# Altium schematic sheet 02_Power.SchDoc
size A3
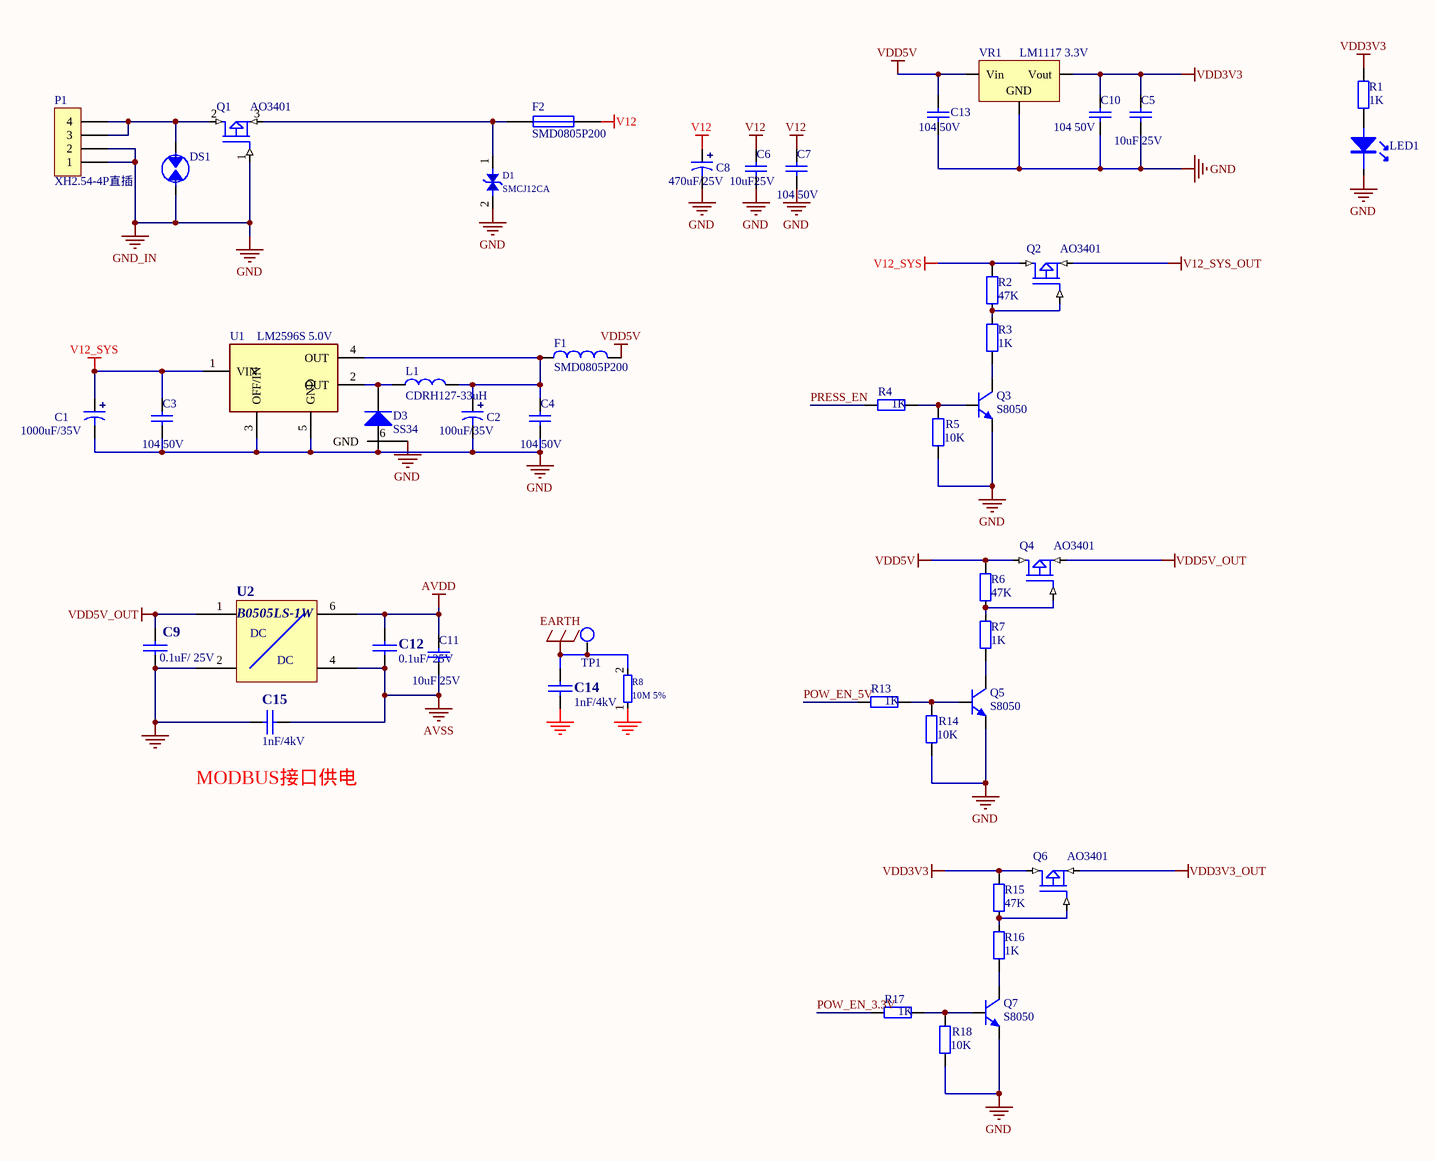
[diagram p0: 02_Power.SchDoc]

## Parts
C1  1000uF/35V  [10*16]
C2  100uF/35V  [6*8]
C3  104 50V  [SMD-0805C]
C4  104 50V  [SMD-0805C]
C5  10uF 25V  [SMD-0603C]
C6  10uF25V  [SMD-0603C]
C7  104 50V  [SMD-0603C]
C8  470uF/25V  [8*12]
C9  0.1uF/ 25V  [0603C]
C10  104 50V  [SMD-0603C]
C11  10uF 25V  [SMD-0603C]
C12  0.1uF/ 25V  [0603C]
C13  104 50V  [SMD-0603C]
C14  1nF/4kV  [CY1]
C15  1nF/4kV  [CY1]
D1  SMCJ12CA  [SMC]
D3  SS34  [SMA]
DS1  UN1812-90CSMD  [SMD-1812]  (value not drawn)
F1  SMD0805P200  [0805r]
F2  SMD0805P200  [PIN-W2/E2.8]
L1  CDRH127-33uH  [CDRH-127]
LED1  蓝光 3528  [SMD-0603D]  (value not drawn)
P1  XH2.54-4P直插  [4X2.54MMZ]
Q1  AO3401  [SOT-23]
Q2  AO3401  [SOT-23]
Q3  S8050  [SOT-23]
Q4  AO3401  [SOT-23]
Q5  S8050  [SOT-23]
Q6  AO3401  [SOT-23]
Q7  S8050  [SOT-23]
R1  1K  [SMD-0603]
R2  47K  [SMD-0603]
R3  1K  [SMD-0603]
R4  1K  [SMD-0603]
R5  10K  [SMD-0603]
R6  47K  [SMD-0603]
R7  1K  [SMD-0603]
R8  10M 5%  [1206r]
R13  1K  [SMD-0603]
R14  10K  [SMD-0603]
R15  47K  [SMD-0603]
R16  1K  [SMD-0603]
R17  1K  [SMD-0603]
R18  10K  [SMD-0603]
TP1  TPS  [tpd]  (value not drawn)
U1  LM2596S 5.0V  [TO-263-5]
U2  B0505LS-1W  [HKSXXXXB-1W]
VR1  LM1117 3.3V  [SOT223]

## Nets
AVDD: C11.2 C12.1 U2.6
AVSS: C11.1 C12.2 C15.1 U2.4
EARTH: C14.1 R8.2 TP1.1
GND: C1.2 C2.2 C3.1 C4.1 C5.1 C6.1 C7.1 C8.2 C9.2 C10.1 C13.1 C14.2 C15.2 D1.2 D3.1(A) DS1.2 LED1.2 P1.1 P1.2 Q1.1(G) Q3.2(E) Q5.2(E) Q7.2(E) R5.1 R8.1 R14.1 R18.1 U1.3(OFF/IN) U1.5(GND) U1.6(GND) U2.2 VR1.1(GND)  [also labelled GND_IN]
V12: C6.2 C7.2 C8.1 F2.2
V12_SYS: C1.1 C3.2 Q2.2(D) R2.1 U1.1(VIN)
V12_SYS_OUT: Q2.3(S)
VDD3V3: C5.2 C10.2 Q6.2(D) R1.1 R15.1 VR1.2(Vout)
VDD3V3_OUT: Q6.3(S)
VDD5V: C13.2 F1.2 Q4.2(D) R6.1 VR1.3(Vin)
VDD5V_OUT: C9.1 Q4.3(S) U2.1
POW_EN_3.3V: R17.1
POW_EN_5V: R13.1
PRESS_EN: R4.1
NetC2_1: C2.1 C4.2 F1.1 L1.2 U1.4(OUT)
NetD1_1: D1.1 F2.1 Q1.3(S)
NetD3_2: D3.2(K) L1.1 U1.2(OUT)
NetDS1_1: DS1.1 P1.3 P1.4 Q1.2(D)
NetLED1_1: LED1.1 R1.2
NetQ2_1: Q2.1(G) R2.2 R3.2
NetQ3_1: Q3.1(B) R4.2 R5.2
NetQ3_3: Q3.3(C) R3.1
NetQ4_1: Q4.1(G) R6.2 R7.2
NetQ5_1: Q5.1(B) R13.2 R14.2
NetQ5_3: Q5.3(C) R7.1
NetQ6_1: Q6.1(G) R15.2 R16.2
NetQ7_1: Q7.1(B) R17.2 R18.2
NetQ7_3: Q7.3(C) R16.1

## Notes on the sheet
- (near C15) MODBUS接口供电
- (in symbol B0505S) DC

## Library data of the parts
C1 C2 C8 = CAP2: 电解电容
C3 C4 C10 C13 = CAP4: 贴片电容 10%
C5-C7 C11 = CAP4: 贴片电容 20%
C9 C12 C14 C15 = CAP: Capacitor
D1 = D_ESD
D3 = DIODE
DS1 = DISCHARE-1: 气体放电管 90V
F1 = Inductor: Code_IEC: 1005; Value: 10mH; Published: 8-Jun-2000; LatestRevisionDate: 29-May-2009; LatestRevisionNote: IPC-7351 Footprint Added.; PackageReference: 0402-A; Publisher: Altium Limited; PackageDescription: Chip Inductor; Code_JEITA: 0402
F2 = Fuse 1: Fuse; Published: 8-Jun-2000; LatestRevisionDate: 17-Jul-2002; LatestRevisionNote: Re-released for DXP Platform.; PackageReference: PIN-W2/E2.8; Publisher: Altium Limited; PackageDescription: Thru-Hole; 2 Leads
L1 = IND
LED1 = LED0: LED 3528 蓝
P1 = SIP-4
Q1 Q2 Q4 Q6 = MOSFET P
Q3 Q5 Q7 = NPN-1: NPN
R1-R7 R13-R18 = R: 贴片电阻 5%
R8 = RES
U1 = LM2596
U2 = B0505S
VR1 = LM1117: 三端稳压器